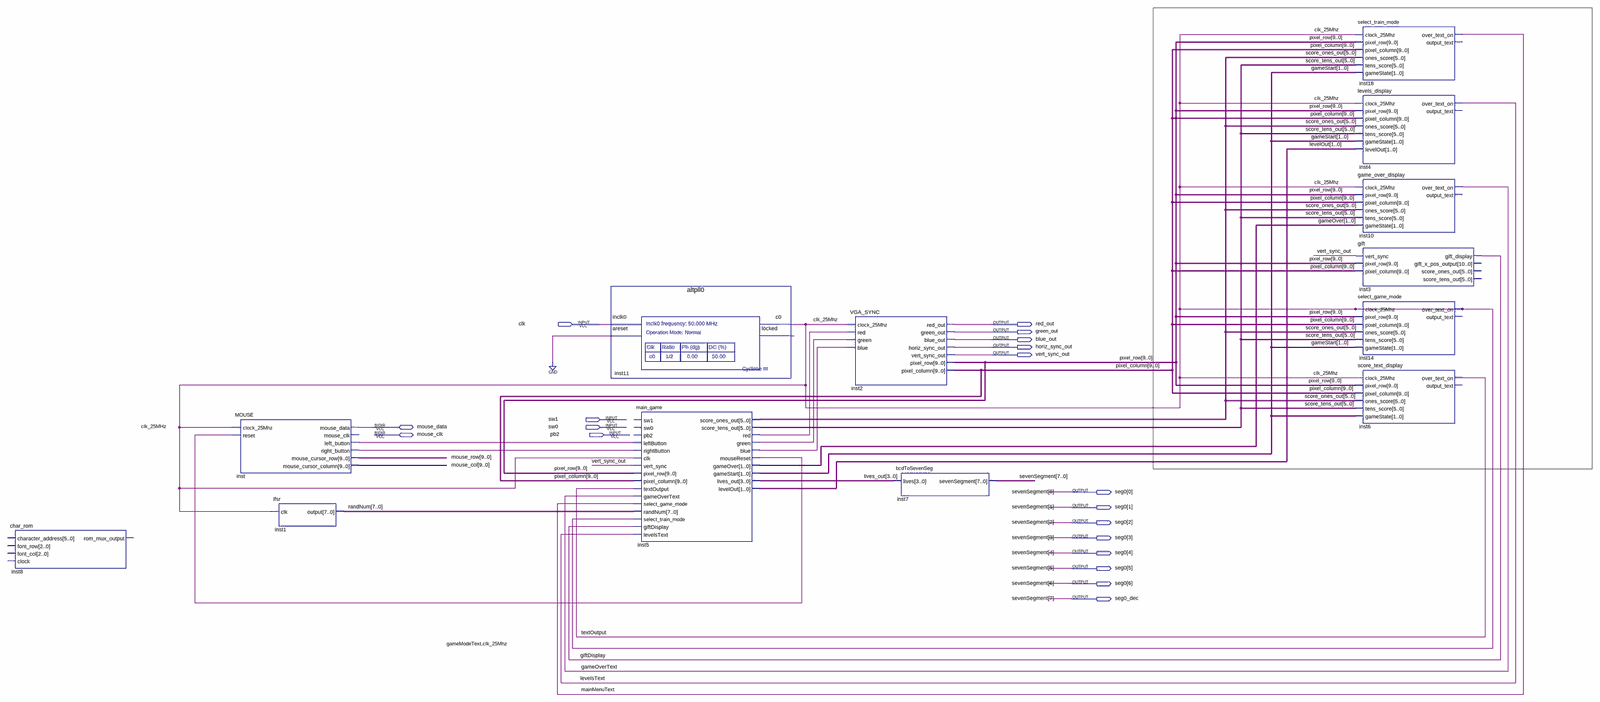
[diagram p0: schematic sheet, whole]
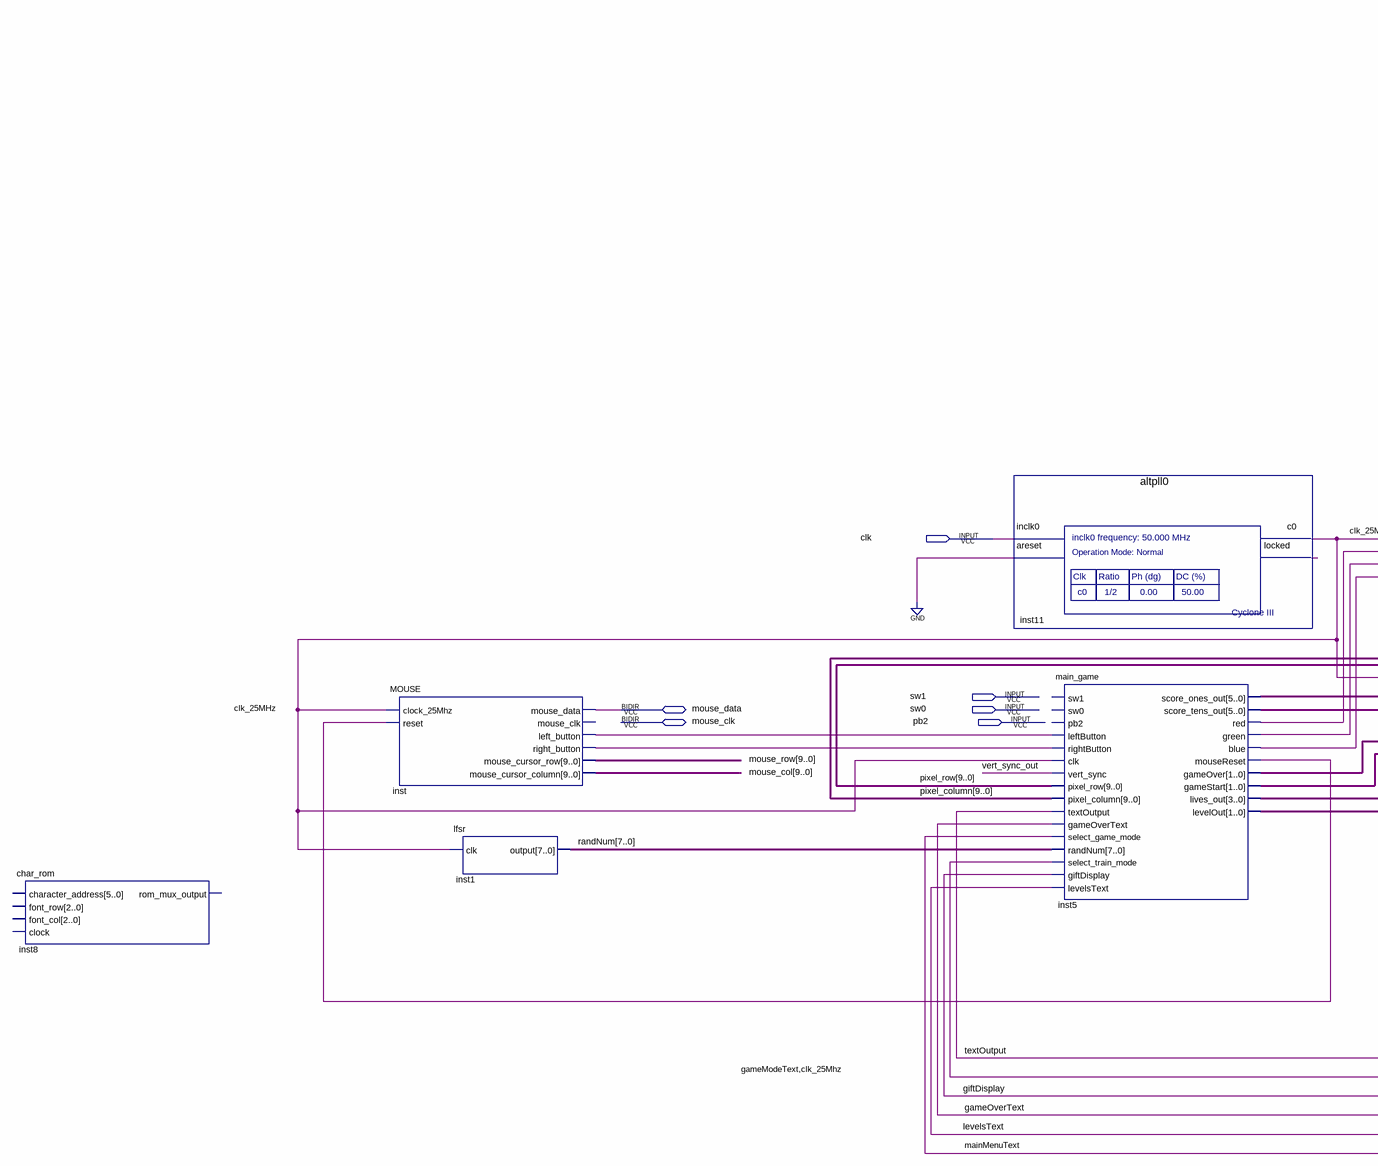
[diagram p1: schematic sheet, left part]
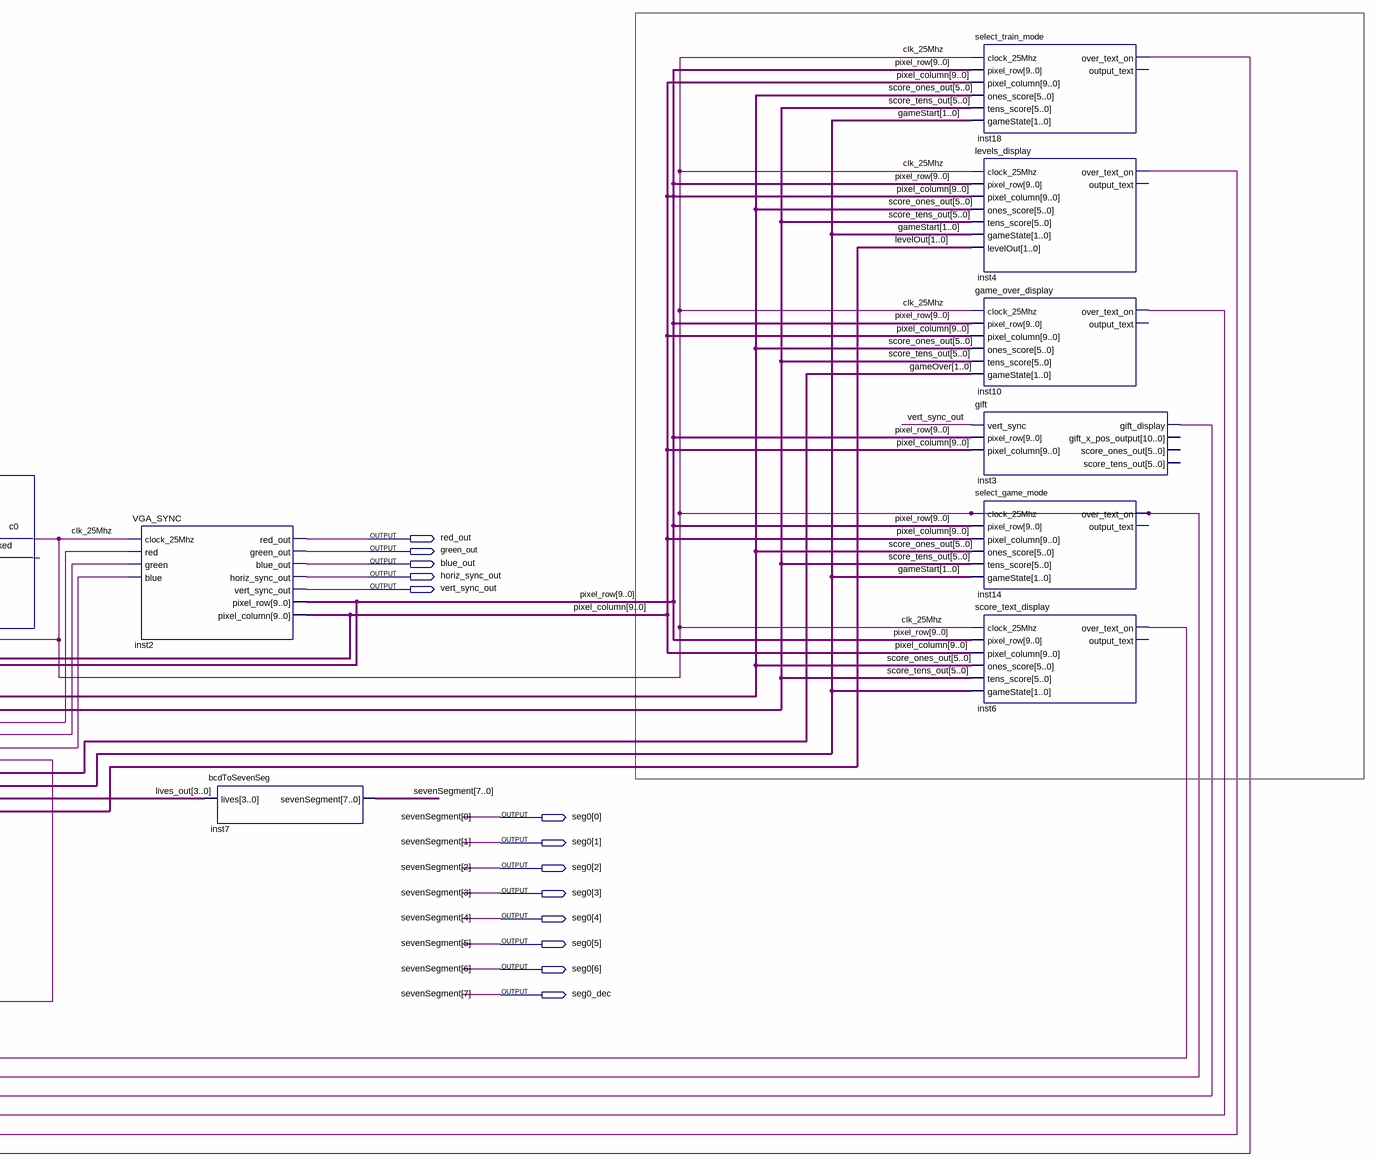
[diagram p2: schematic sheet, right part]
// Quartus schematic MiniProject.bdf as structural Verilog: 13 symbols, 19 pins
module MiniProject (
  input  clk,
  input  sw1,
  input  sw0,
  input  pb2,
  inout  mouse_data,
  inout  mouse_clk,
  output red_out,
  output green_out,
  output blue_out,
  output horiz_sync_out,
  output vert_sync_out,
  output [6:0] seg0,
  output seg0_dec
);

  wire clk_25Mhz, gameModeText, gameOverText, giftDisplay, inst5_blue, inst5_green, inst5_mousereset,
       inst5_red, inst11_locked, inst_left_button, inst_right_button, levelsText, mainMenuText, textOutput;
  wire [1:0] gameOver, gameStart, levelOut;
  wire [3:0] lives_out;
  wire [5:0] score_ones_out, score_tens_out;
  wire [7:0] randNum;
  wire [9:0] mouse_col, mouse_row, pixel_column, pixel_row;

  char_rom inst8 ();  // open: character_address, font_row, font_col, clock, rom_mux_output
  MOUSE inst (
    .clock_25Mhz(clk_25Mhz), .reset(inst5_mousereset), .left_button(inst_left_button),
    .right_button(inst_right_button), .mouse_cursor_row(mouse_row), .mouse_cursor_column(mouse_col),
    .mouse_data(mouse_data));  // open: mouse_clk
  lfsr inst1 (.clk({gameModeText, clk_25Mhz}), .\output (randNum));
  altpll0 inst11 (.inclk0(clk), .areset(1'b0), .c0({gameModeText, clk_25Mhz}), .locked(inst11_locked));
  main_game inst5 (
    .leftButton(inst_left_button), .rightButton(inst_right_button), .clk({gameModeText, clk_25Mhz}),
    .vert_sync(vert_sync_out), .pixel_row(pixel_row), .pixel_column(pixel_column), .textOutput(textOutput),
    .gameOverText(gameOverText), .select_game_mode(mainMenuText), .randNum(randNum),
    .select_train_mode({gameModeText, clk_25Mhz}), .giftDisplay(giftDisplay), .levelsText(levelsText),
    .score_ones_out(score_ones_out), .score_tens_out(score_tens_out), .red(inst5_red), .green(inst5_green),
    .blue(inst5_blue), .mouseReset(inst5_mousereset), .gameOver(gameOver), .gameStart(gameStart),
    .lives_out(lives_out), .levelOut(levelOut));  // open: sw1, sw0, pb2
  VGA_SYNC inst2 (
    .clock_25Mhz(clk_25Mhz), .red(inst5_red), .green(inst5_green), .blue(inst5_blue), .red_out(red_out),
    .green_out(green_out), .blue_out(blue_out), .horiz_sync_out(horiz_sync_out),
    .vert_sync_out(vert_sync_out), .pixel_row(pixel_row), .pixel_column(pixel_column));
  bcdToSevenSeg inst7 (.lives(lives_out), .sevenSegment({seg0_dec, seg0}));
  select_train_mode inst18 (
    .clock_25Mhz(clk_25Mhz), .pixel_row(pixel_row), .pixel_column(pixel_column), .ones_score(score_ones_out),
    .tens_score(score_tens_out), .gameState(gameStart), .over_text_on(mainMenuText));  // open: output_text
  levels_display inst4 (
    .clock_25Mhz(clk_25Mhz), .pixel_row(pixel_row), .pixel_column(pixel_column), .ones_score(score_ones_out),
    .tens_score(score_tens_out), .gameState(gameStart), .levelOut(levelOut), .over_text_on(levelsText));  // open: output_text
  game_over_display inst10 (
    .clock_25Mhz(clk_25Mhz), .pixel_row(pixel_row), .pixel_column(pixel_column), .ones_score(score_ones_out),
    .tens_score(score_tens_out), .gameState(gameOver), .over_text_on(gameOverText));  // open: output_text
  gift inst3 (
    .vert_sync(vert_sync_out), .pixel_row(pixel_row), .pixel_column(pixel_column), .gift_display(giftDisplay));  // open: gift_x_pos_output, score_ones_out, score_tens_out
  select_game_mode inst14 (
    .clock_25Mhz({gameModeText, clk_25Mhz}), .pixel_row(pixel_row), .pixel_column(pixel_column),
    .ones_score(score_ones_out), .tens_score(score_tens_out), .gameState(gameStart),
    .over_text_on({gameModeText, clk_25Mhz}));  // open: output_text
  score_text_display inst6 (
    .clock_25Mhz(clk_25Mhz), .pixel_row(pixel_row), .pixel_column(pixel_column), .ones_score(score_ones_out),
    .tens_score(score_tens_out), .gameState(gameStart), .over_text_on(textOutput));  // open: output_text

  // Other names for the same wires on the sheet: sevenSegment[7:0] = {seg0_dec, seg0}
endmodule
